# Altium schematic sheet LOGIC_FPGA.SchDoc: FPGA Logic
size B; Engineer: M. Jones; Organization: Michael Jones; DocumentNumber: 4; Revision: RA2.1; SheetNumber: 4; SheetTotal: 7
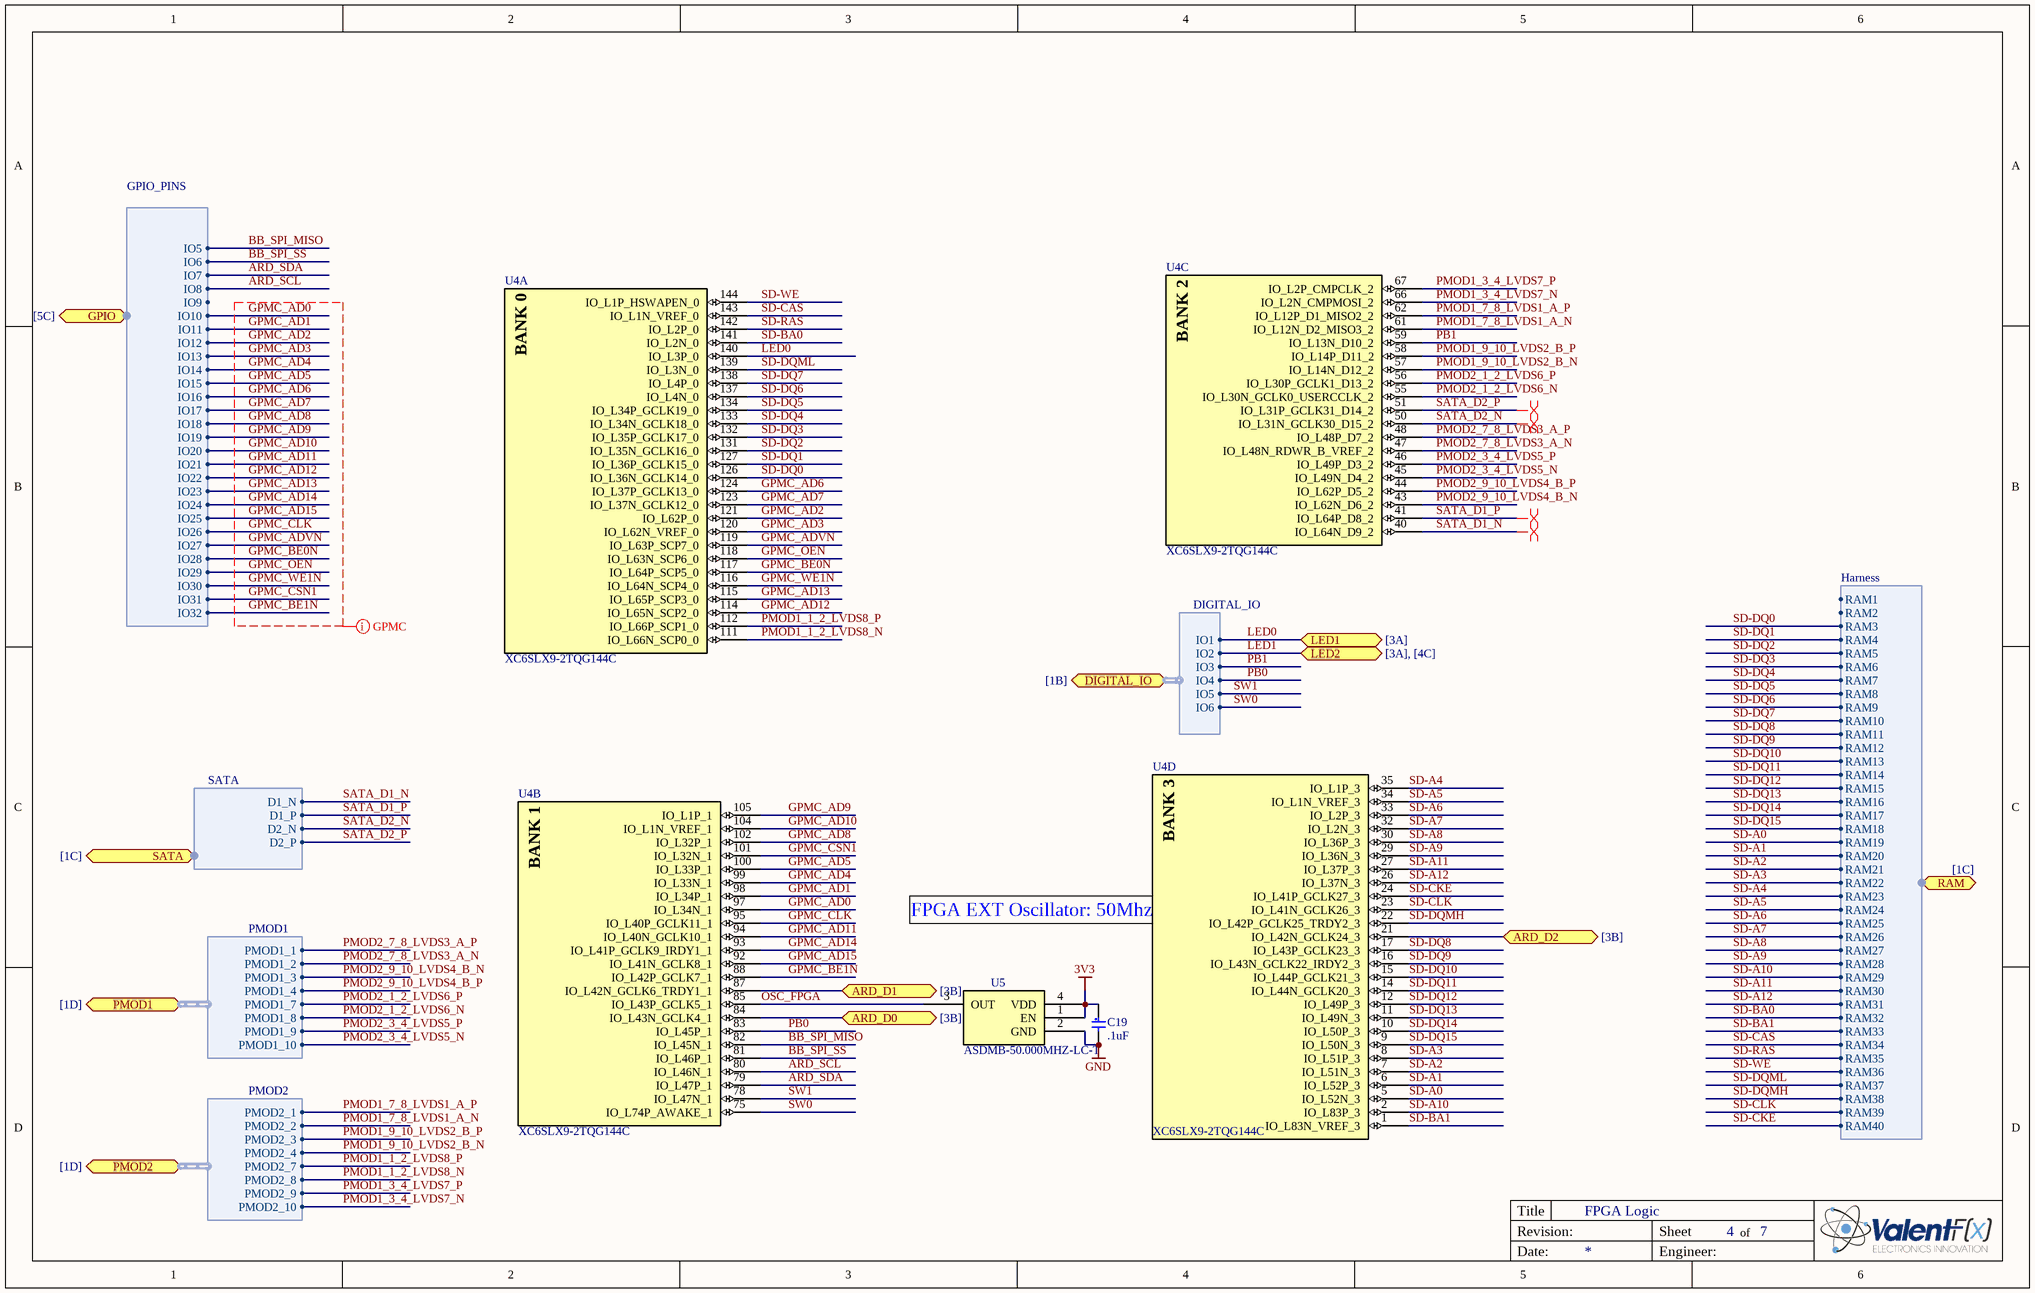
[diagram p0: LOGIC_FPGA.SchDoc]

## Parts
C19  .1uF  [c0603]
U4  XC6SLX9-2TQG144C  [TQ144_L]  (parts A,B,C,D of 7)
U5  ASDMB-50.000MHZ-LC-T  [ASDMB - osc]

## Ports
ARD_D0 (see [3B]), ARD_D1 (see [3B]), ARD_D2 (see [3B]), DIGITAL_IO (harness DIGITAL_IO, see [1B]), GPIO (harness GPIO_PINS, see [5C]), LED1 (see [3A]), LED2 (see [3A], [4C]), PMOD1 (harness PMOD1, see [1D]), PMOD2 (harness PMOD2, see [1D]), RAM (harness Harness, see [1C]), SATA (harness SATA, see [1C])

## Harnesses
SATA: D1_P, D1_N, D2_N, D2_P
Harness: RAM1, RAM2, RAM3, RAM4, RAM5, RAM6, RAM7, RAM8, RAM9, RAM10, RAM11, RAM12, RAM13, RAM14, RAM15, RAM16, RAM17, RAM18, RAM19, RAM20, RAM21, RAM22, RAM23, RAM24, RAM25, RAM26, RAM27, RAM28, RAM29, RAM30, RAM31, RAM32, RAM33, RAM34, RAM35, RAM36, RAM37, RAM38, RAM39, RAM40
PMOD1: PMOD1_1, PMOD1_2, PMOD1_3, PMOD1_4, PMOD1_7, PMOD1_8, PMOD1_9, PMOD1_10
PMOD2: PMOD2_1, PMOD2_2, PMOD2_3, PMOD2_4, PMOD2_7, PMOD2_8, PMOD2_9, PMOD2_10
DIGITAL_IO: IO1, IO2, IO3, IO4, IO5, IO6
GPIO_PINS: IO5, IO6, IO7, IO8, IO9, IO10, IO11, IO12, IO13, IO14, IO15, IO16, IO17, IO18, IO19, IO20, IO21, IO22, IO23, IO24, IO25, IO26, IO27, IO28, IO29, IO30, IO31, IO32

## Nets
3V3: C19.1 U5.1(EN) U5.4(VDD)
GND: C19.2 U5.2(GND)
ARD_D0: U4.84(IO_L43N_GCLK4_1) ; port ARD_D0
ARD_D1: U4.87(IO_L42N_GCLK6_TRDY1_1) ; port ARD_D1
ARD_D2: U4.21(IO_L42N_GCLK24_3) ; port ARD_D2
ARD_SCL: U4.80(IO_L46N_1) ; port GPIO.IO8
ARD_SDA: U4.79(IO_L47P_1) ; port GPIO.IO7
BB_SPI_MISO: U4.82(IO_L45N_1) ; port GPIO.IO5
BB_SPI_SS: U4.81(IO_L46P_1) ; port GPIO.IO6
GPMC_AD0: U4.97(IO_L34N_1) ; port GPIO.IO10
GPMC_AD1: U4.98(IO_L34P_1) ; port GPIO.IO11
GPMC_AD2: U4.121(IO_L62P_0) ; port GPIO.IO12
GPMC_AD3: U4.120(IO_L62N_VREF_0) ; port GPIO.IO13
GPMC_AD4: U4.99(IO_L33N_1) ; port GPIO.IO14
GPMC_AD5: U4.100(IO_L33P_1) ; port GPIO.IO15
GPMC_AD6: U4.124(IO_L37P_GCLK13_0) ; port GPIO.IO16
GPMC_AD7: U4.123(IO_L37N_GCLK12_0) ; port GPIO.IO17
GPMC_AD8: U4.102(IO_L32P_1) ; port GPIO.IO18
GPMC_AD9: U4.105(IO_L1P_1) ; port GPIO.IO19
GPMC_AD10: U4.104(IO_L1N_VREF_1) ; port GPIO.IO20
GPMC_AD11: U4.94(IO_L40N_GCLK10_1) ; port GPIO.IO21
GPMC_AD12: U4.114(IO_L65N_SCP2_0) ; port GPIO.IO22
GPMC_AD13: U4.115(IO_L65P_SCP3_0) ; port GPIO.IO23
GPMC_AD14: U4.93(IO_L41P_GCLK9_IRDY1_1) ; port GPIO.IO24
GPMC_AD15: U4.92(IO_L41N_GCLK8_1) ; port GPIO.IO25
GPMC_ADVN: U4.119(IO_L63P_SCP7_0) ; port GPIO.IO27
GPMC_BE0N: U4.117(IO_L64P_SCP5_0) ; port GPIO.IO28
GPMC_BE1N: U4.88(IO_L42P_GCLK7_1) ; port GPIO.IO32
GPMC_CLK: U4.95(IO_L40P_GCLK11_1) ; port GPIO.IO26
GPMC_CSN1: U4.101(IO_L32N_1) ; port GPIO.IO31
GPMC_OEN: U4.118(IO_L63N_SCP6_0) ; port GPIO.IO29
GPMC_WE1N: U4.116(IO_L64N_SCP4_0) ; port GPIO.IO30
LED0: U4.140(IO_L3P_0) ; port LED1, port DIGITAL_IO.IO1
LED1: port LED2, port DIGITAL_IO.IO2
OSC_FPGA: U4.85(IO_L43P_GCLK5_1) U5.3(OUT)
PB0: U4.83(IO_L45P_1) ; port DIGITAL_IO.IO4
PB1: U4.59(IO_L13N_D10_2) ; port DIGITAL_IO.IO3
PMOD1_1_2_LVDS8_N: U4.111(IO_L66N_SCP0_0) ; port PMOD2.PMOD2_8
PMOD1_1_2_LVDS8_P: U4.112(IO_L66P_SCP1_0) ; port PMOD2.PMOD2_7
PMOD1_3_4_LVDS7_N: U4.66(IO_L2N_CMPMOSI_2) ; port PMOD2.PMOD2_10
PMOD1_3_4_LVDS7_P: U4.67(IO_L2P_CMPCLK_2) ; port PMOD2.PMOD2_9
PMOD1_7_8_LVDS1_A_N: U4.61(IO_L12N_D2_MISO3_2) ; port PMOD2.PMOD2_2
PMOD1_7_8_LVDS1_A_P: U4.62(IO_L12P_D1_MISO2_2) ; port PMOD2.PMOD2_1
PMOD1_9_10_LVDS2_B_N: U4.57(IO_L14N_D12_2) ; port PMOD2.PMOD2_4
PMOD1_9_10_LVDS2_B_P: U4.58(IO_L14P_D11_2) ; port PMOD2.PMOD2_3
PMOD2_1_2_LVDS6_N: U4.55(IO_L30N_GCLK0_USERCCLK_2) ; port PMOD1.PMOD1_8
PMOD2_1_2_LVDS6_P: U4.56(IO_L30P_GCLK1_D13_2) ; port PMOD1.PMOD1_7
PMOD2_3_4_LVDS5_N: U4.45(IO_L49N_D4_2) ; port PMOD1.PMOD1_10
PMOD2_3_4_LVDS5_P: U4.46(IO_L49P_D3_2) ; port PMOD1.PMOD1_9
PMOD2_7_8_LVDS3_A_N: U4.47(IO_L48N_RDWR_B_VREF_2) ; port PMOD1.PMOD1_2
PMOD2_7_8_LVDS3_A_P: U4.48(IO_L48P_D7_2) ; port PMOD1.PMOD1_1
PMOD2_9_10_LVDS4_B_N: U4.43(IO_L62N_D6_2) ; port PMOD1.PMOD1_3
PMOD2_9_10_LVDS4_B_P: U4.44(IO_L62P_D5_2) ; port PMOD1.PMOD1_4
SATA_D1_N: U4.40(IO_L64N_D9_2) ; port SATA.D1_N
SATA_D1_P: U4.41(IO_L64P_D8_2) ; port SATA.D1_P
SATA_D2_N: U4.50(IO_L31N_GCLK30_D15_2) ; port SATA.D2_N
SATA_D2_P: U4.51(IO_L31P_GCLK31_D14_2) ; port SATA.D2_P
SD-A0: U4.5(IO_L52N_3) ; port RAM.RAM19
SD-A1: U4.6(IO_L52P_3) ; port RAM.RAM20
SD-A2: U4.7(IO_L51N_3) ; port RAM.RAM21
SD-A3: U4.8(IO_L51P_3) ; port RAM.RAM22
SD-A4: U4.35(IO_L1P_3) ; port RAM.RAM23
SD-A5: U4.34(IO_L1N_VREF_3) ; port RAM.RAM24
SD-A6: U4.33(IO_L2P_3) ; port RAM.RAM25
SD-A7: U4.32(IO_L2N_3) ; port RAM.RAM26
SD-A8: U4.30(IO_L36P_3) ; port RAM.RAM27
SD-A9: U4.29(IO_L36N_3) ; port RAM.RAM28
SD-A10: U4.2(IO_L83P_3) ; port RAM.RAM29
SD-A11: U4.27(IO_L37P_3) ; port RAM.RAM30
SD-A12: U4.26(IO_L37N_3) ; port RAM.RAM31
SD-BA0: U4.141(IO_L2N_0) ; port RAM.RAM32
SD-BA1: U4.1(IO_L83N_VREF_3) ; port RAM.RAM33
SD-CAS: U4.143(IO_L1N_VREF_0) ; port RAM.RAM34
SD-CKE: U4.24(IO_L41P_GCLK27_3) ; port RAM.RAM40
SD-CLK: U4.23(IO_L41N_GCLK26_3) ; port RAM.RAM39
SD-DQ0: U4.126(IO_L36N_GCLK14_0) ; port RAM.RAM3
SD-DQ1: U4.127(IO_L36P_GCLK15_0) ; port RAM.RAM4
SD-DQ2: U4.131(IO_L35N_GCLK16_0) ; port RAM.RAM5
SD-DQ3: U4.132(IO_L35P_GCLK17_0) ; port RAM.RAM6
SD-DQ4: U4.133(IO_L34N_GCLK18_0) ; port RAM.RAM7
SD-DQ5: U4.134(IO_L34P_GCLK19_0) ; port RAM.RAM8
SD-DQ6: U4.137(IO_L4N_0) ; port RAM.RAM9
SD-DQ7: U4.138(IO_L4P_0) ; port RAM.RAM10
SD-DQ8: U4.17(IO_L43P_GCLK23_3) ; port RAM.RAM11
SD-DQ9: U4.16(IO_L43N_GCLK22_IRDY2_3) ; port RAM.RAM12
SD-DQ10: U4.15(IO_L44P_GCLK21_3) ; port RAM.RAM13
SD-DQ11: U4.14(IO_L44N_GCLK20_3) ; port RAM.RAM14
SD-DQ12: U4.12(IO_L49P_3) ; port RAM.RAM15
SD-DQ13: U4.11(IO_L49N_3) ; port RAM.RAM16
SD-DQ14: U4.10(IO_L50P_3) ; port RAM.RAM17
SD-DQ15: U4.9(IO_L50N_3) ; port RAM.RAM18
SD-DQMH: U4.22(IO_L42P_GCLK25_TRDY2_3) ; port RAM.RAM38
SD-DQML: U4.139(IO_L3N_0) ; port RAM.RAM37
SD-RAS: U4.142(IO_L2P_0) ; port RAM.RAM35
SD-WE: U4.144(IO_L1P_HSWAPEN_0) ; port RAM.RAM36
SW0: U4.75(IO_L74P_AWAKE_1) ; port DIGITAL_IO.IO6
SW1: U4.78(IO_L47N_1) ; port DIGITAL_IO.IO5

## Layout directives
net class GPMC: GPMC_AD0, GPMC_AD1, GPMC_AD2, GPMC_AD3, GPMC_AD4, GPMC_AD5, GPMC_AD6, GPMC_AD7, GPMC_AD8, GPMC_AD9, GPMC_AD10, GPMC_AD11, GPMC_AD12, GPMC_AD13, GPMC_AD14, GPMC_AD15, GPMC_ADVN, GPMC_BE0N, GPMC_BE1N, GPMC_CLK, GPMC_CSN1, GPMC_OEN, GPMC_WE1N
differential pair: SATA_D1_N, SATA_D1_P, SATA_D2_N, SATA_D2_P

## Notes on the sheet
- FPGA EXT Oscillator: 50Mhz
- Title
- Revision:
- Sheet
- of
- Date:
- Engineer:
- (in symbol FPGA - XC6SLX9-2TQG144C, part A) BANK 0
- (in symbol FPGA - XC6SLX9-2TQG144C, part B) BANK 1
- (in symbol FPGA - XC6SLX9-2TQG144C, part C) BANK 2
- (in symbol FPGA - XC6SLX9-2TQG144C, part D) BANK 3

## Library data of the parts
C19 = C0603 - CL10F104ZA8NNNC: CAP CER 0.1UF 25V Y5V 0603; Manufacturer: Samsung Electro-Mechanics America, Inc; Capacitance: 0.1µF; Tolerance: -20%, +80%; Temperature Coefficient: Y5V (F); Accept Alternative: Yes; Manufacturer Part Number: CL10F104ZA8NNNC; Value: .1uF; Supplier 1: Digi-Key; Supplier Part Number 1: 1276-1011-1-ND; RoHS: RoHS Compliant; Category: Capacitors; Stock 1: 400907; Pricing 1: 1=0.1, 10=0.017, 25=0.012, 50=0.009, 100=0.0076, 250=0.00624, 500=0.00536, 1000=0.00417 (USD); Package / Case: 0603 (1608 Metric); Packaging: Cut Tape (CT); ComponentLink1URL: http://www.samsungsem.com/servlet/FileDownload?type=spec&file=CL10F104ZA8NNNC.pdf; ComponentLink1Description: http://www.samsungsem.com/servlet/FileDownload?type=spec&file=CL10F104ZA8NNNC.pdf; Voltage - Rated: 25V; Mounting Type: Surface Mount, MLCC; Operating Temperature: -30°C ~ 85°C; Applications: General Purpose; Ratings: -; Size / Dimension: 0.063" L x 0.031" W (1.60mm x 0.80mm); Height - Seated (Max): -; Thickness (Max): 0.035" (0.90mm); Lead Spacing: -; Features: -; Lead Style: -; Accept Compatible Replacement Part: Yes
U4 = FPGA - XC6SLX9-2TQG144C: IC FPAG SPARTAN 6 9K 144TQFP; Manufacturer: Xilinx Inc; Number of Logic Elements/Cells: 9152; Number of LABs/CLBs: 715; Total RAM Bits: 589824; Number of I /O: 102; Voltage - Supply: 1.14 V ~ 1.26 V; Supplier 1: America II Electronics; Supplier Part Number 1: 122-1745-ND; Manufacturer Part Number: XC6SLX9-2TQG144C; RoHS: RoHS Compliant; Category: Integrated Circuits (ICs); Stock 1: 994; Pricing 1: 1=12.80,1=11.05,1000=9.59 (USD); Number of Gates: -; Mounting Type: Surface Mount; Operating Temperature: 0°C ~ 85°C; Package / Case: 144-LQFP; Supplier Device Package: 144-TQFP (20x20); ComponentLink1URL: http://www.xilinx.com/support/documentation/data_sheets/ds160.pdf; ComponentLink1Description: http://www.xilinx.com/support/documentation/data_sheets/ds160.pdf; Value: XC6SLX9-2TQG144C; Supplier 2: Digi-Key
U5 = ASDMB-50.000MHZ-LC-T: OSC MEMS 50.000 MHZ SMD; Manufacturer: Abracon Corporation; Frequency: 50MHz; Function: Tri-State (Output Enable); Output: CMOS; Voltage - Supply: 1.8 V ~ 3.3 V; Frequency Stability: ±50ppm; Current - Supply (Max): 16mA; Current - Supply (Disable) (Max): 15µA; Supplier 1: Digi-Key; Manufacturer Part Number: ASDMB-50.000MHZ-LC-T; RoHS: RoHS Compliant; Category: Crystals and Oscillators; Stock 1: 967; Pricing 1: 1=1.69, 10=1.463, 50=1.2826, 100=1.0125, 500=0.855 (USD); Type: MEMS (Silicon); Operating Temperature: -40°C ~ 85°C; Mounting Type: Surface Mount; Size / Dimension: 0.098" L x 0.079" W (2.50mm x 2.00mm); Height: 0.035" (0.90mm); Package / Case: 4-SMD, No Lead (DFN, LCC); Packaging: Cut Tape (CT); ComponentLink1URL: http://www.abracon.com/Oscillators/ASDMB.pdf; ComponentLink1Description: http://www.abracon.com/Oscillators/ASDMB.pdf; Supplier Part Number 1: 535-11738-1-ND; Value: ASDMB-50.000MHZ-LC-T